# Altium schematic sheet Display Interfaces.SchDoc
size Tabloid; DrawnBy: Krutav Shah; SheetNumber: 6; SheetTotal: 7
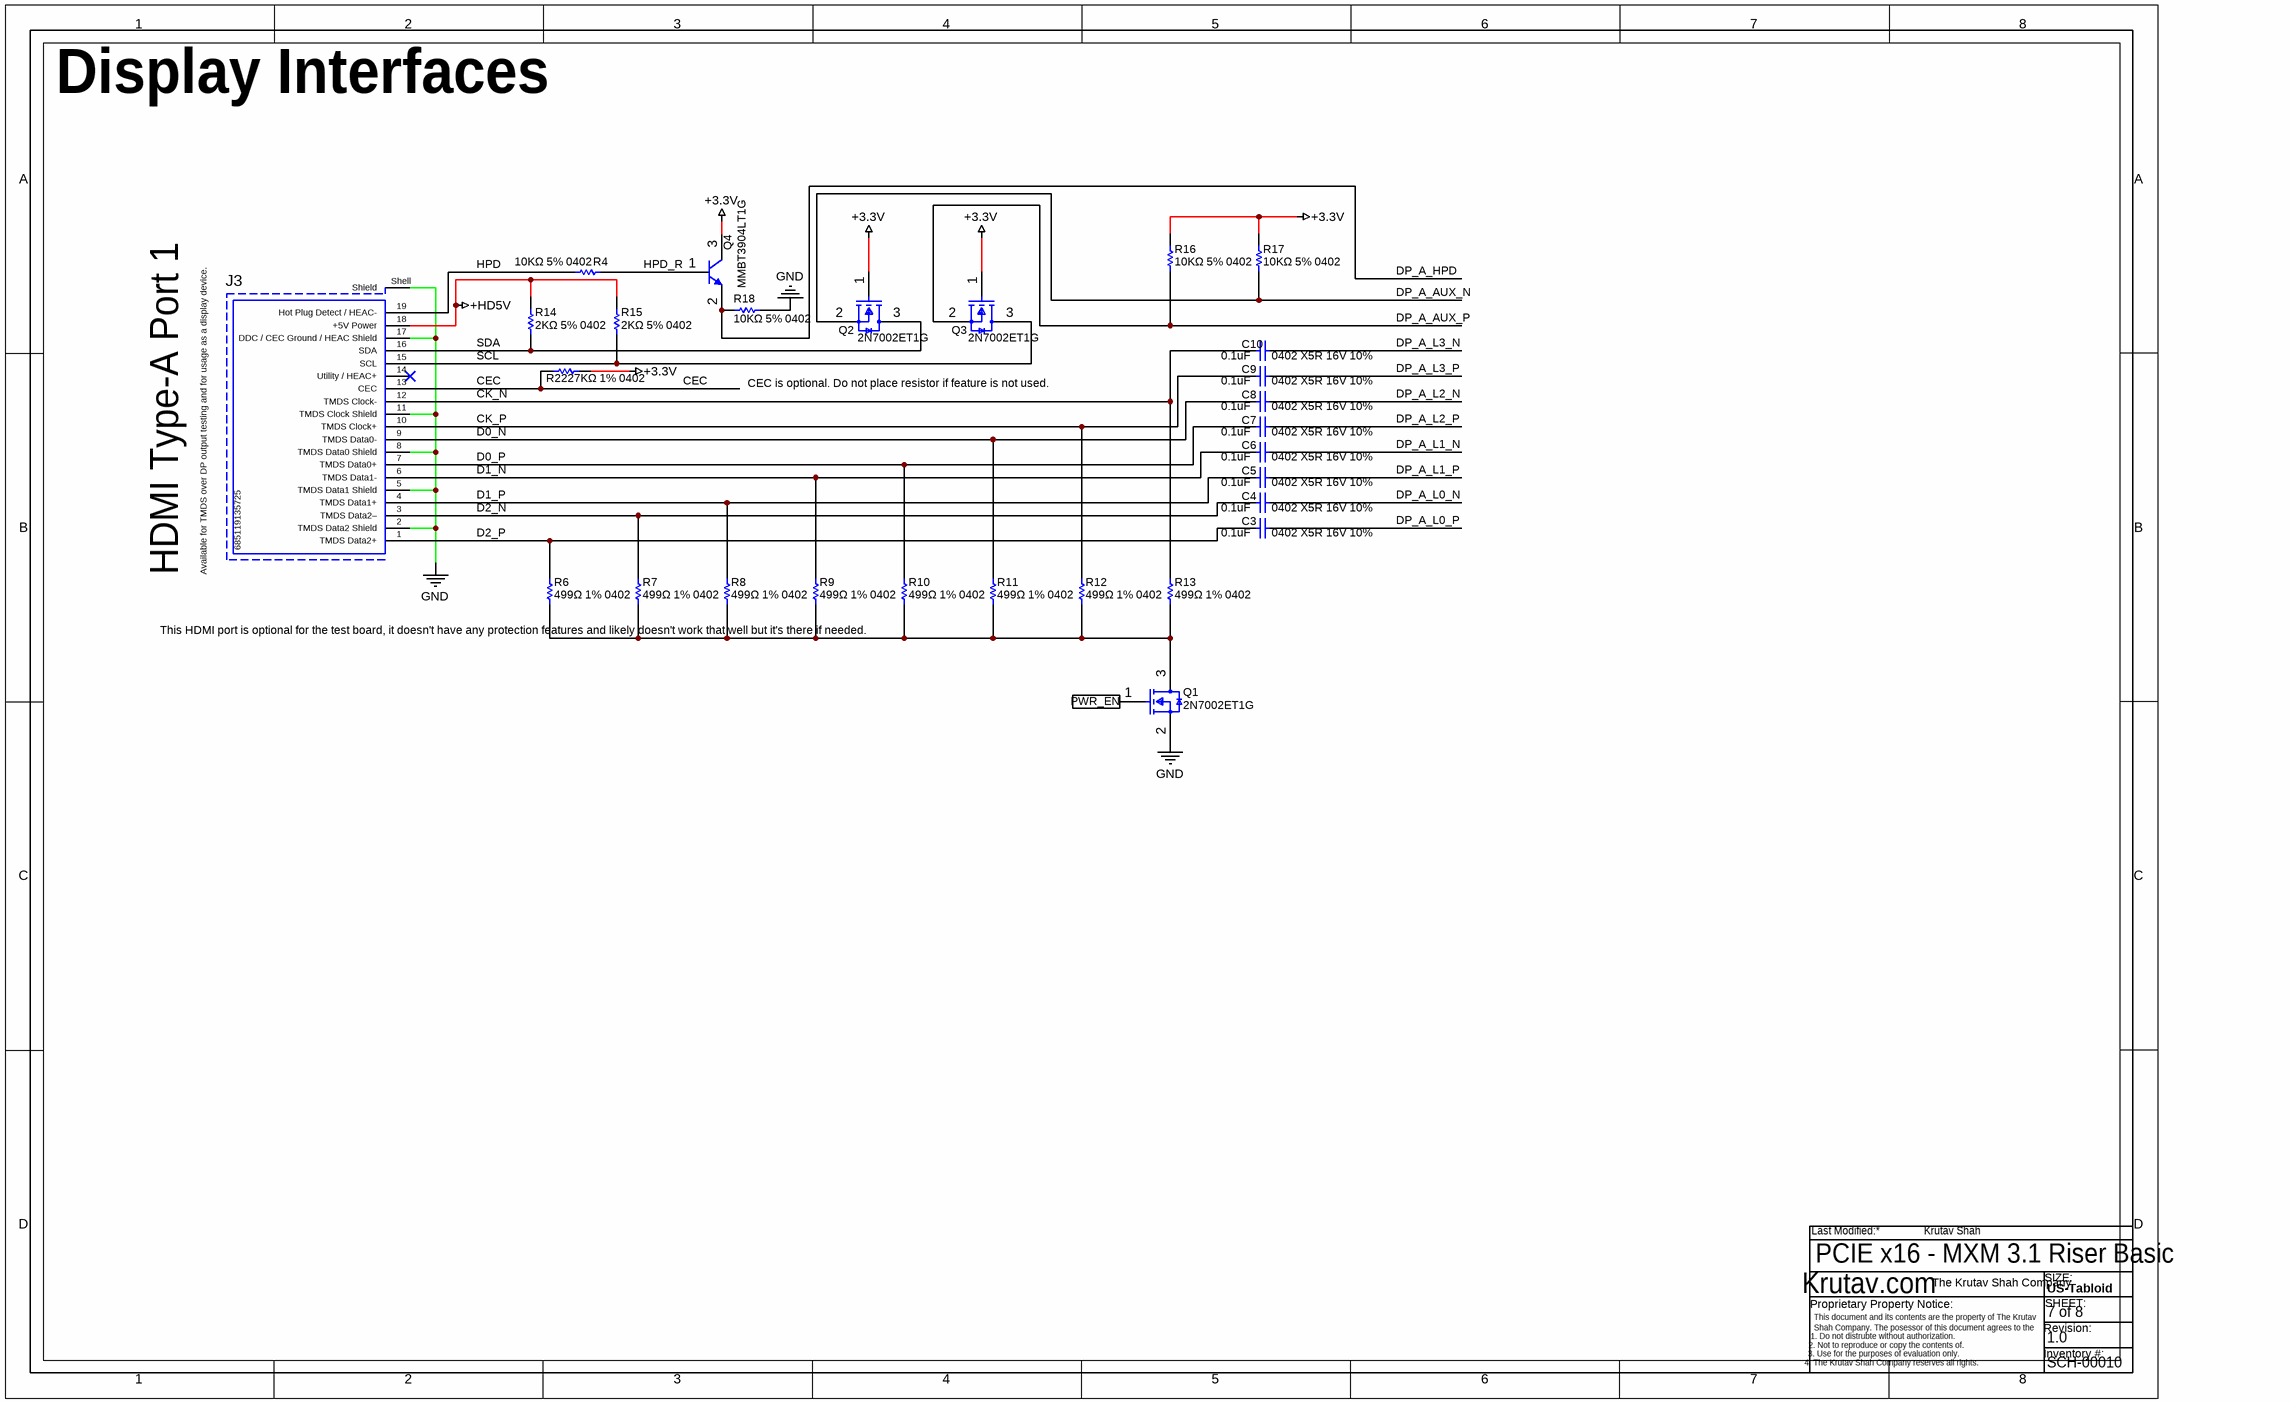
[diagram p0: Display Interfaces.SchDoc]

## Parts
C3  0.1uF       0402 X5R 16V 10%  [CAPC0603X33X15NL03T05]
C4  0.1uF       0402 X5R 16V 10%  [CAPC0603X33X15NL03T05]
C5  0.1uF       0402 X5R 16V 10%  [CAPC0603X33X15NL03T05]
C6  0.1uF       0402 X5R 16V 10%  [CAPC0603X33X15NL03T05]
C7  0.1uF       0402 X5R 16V 10%  [CAPC0603X33X15NL03T05]
C8  0.1uF       0402 X5R 16V 10%  [CAPC0603X33X15NL03T05]
C9  0.1uF       0402 X5R 16V 10%  [CAPC0603X33X15NL03T05]
C10  0.1uF       0402 X5R 16V 10%  [CAPC0603X33X15NL03T05]
J3  685119135725  [685119135725]
Q1  2N7002ET1G  [FP-318-08-IPC_A]
Q2  2N7002ET1G  [FP-318-08-IPC_A]
Q3  2N7002ET1G  [FP-318-08-IPC_A]
Q4  MMBT3904LT1G  [ONSC-SOT-23-3-318-08_V]
R4  10KΩ 5% 0402  [RESC0201(0603)_L]
R6  499Ω 1% 0402  [RESC0201(0603)_L]
R7  499Ω 1% 0402  [RESC0201(0603)_L]
R8  499Ω 1% 0402  [RESC0201(0603)_L]
R9  499Ω 1% 0402  [RESC0201(0603)_L]
R10  499Ω 1% 0402  [RESC0201(0603)_L]
R11  499Ω 1% 0402  [RESC0201(0603)_L]
R12  499Ω 1% 0402  [RESC0201(0603)_L]
R13  499Ω 1% 0402  [RESC0201(0603)_L]
R14  2KΩ 5% 0402  [RESC0201(0603)_L]
R15  2KΩ 5% 0402  [RESC0201(0603)_L]
R16  10KΩ 5% 0402  [RESC0201(0603)_L]
R17  10KΩ 5% 0402  [RESC0201(0603)_L]
R18  10KΩ 5% 0402  [RESC0201(0603)_L]
R22  27KΩ 1% 0402  [RESC0201(0603)_L]

## Ports
PWR_EN

## Nets
+3.3V: Q2.1(Gate) Q3.1(Gate) Q4.3(C) R16.1 R17.1 R22.1
+HD5V: J3.18(+5V_Power) R14.1 R15.1
GND: J3.2(TMDS_Data2_Shield) J3.5(TMDS_Data1_Shield) J3.8(TMDS_Data0_Shield) J3.11(TMDS_Clock_Shield) J3.17(DDC_/_CEC_Ground_/_HEAC_Shield) J3.Shell(Shield) Q1.2(Source) R18.2
CEC: J3.13(CEC) R22.2
CK_N: C10.1 J3.12(TMDS_Clock-) R13.1
CK_P: C9.1 J3.10(TMDS_Clock+) R12.1
D0_N: C8.1 J3.9(TMDS_Data0-) R11.1
D0_P: C7.1 J3.7(TMDS_Data0+) R10.1
D1_N: C6.1 J3.6(TMDS_Data1-) R9.1
D1_P: C5.1 J3.4(TMDS_Data1+) R8.1
D2_N: C4.1 J3.3(TMDS_Data2–) R7.1
D2_P: C3.1 J3.1(TMDS_Data2+) R6.1
DP_A_AUX_N: Q2.2(Source) R17.2
DP_A_AUX_P: Q3.2(Source) R16.2
DP_A_HPD: Q4.2(E) R18.1
DP_A_L0_N: C4.2
DP_A_L0_P: C3.2
DP_A_L1_N: C6.2
DP_A_L1_P: C5.2
DP_A_L2_N: C8.2
DP_A_L2_P: C7.2
DP_A_L3_N: C10.2
DP_A_L3_P: C9.2
HPD: J3.19(Hot_Plug_Detect_/_HEAC-) R4.2
HPD_R: Q4.1(B) R4.1
PWR_EN: Q1.1(Gate) ; port PWR_EN
SCL: J3.15(SCL) Q3.3(Drain) R15.2
SDA: J3.16(SDA) Q2.3(Drain) R14.2
NetQ1_3: Q1.3(Drain) R6.2 R7.2 R8.2 R9.2 R10.2 R11.2 R12.2 R13.2

Not connected (* = marked no-connect by the designer): J3 14(Utility_/_HEAC+)*

## Layout directives
differential pair: CK_N, CK_P, D0_N, D0_P, D1_N, D1_P, D2_N, D2_P, DP_A_AUX_N, DP_A_AUX_P, DP_A_L0_N, DP_A_L0_P, DP_A_L1_N, DP_A_L1_P, DP_A_L2_N, DP_A_L2_P, DP_A_L3_N, DP_A_L3_P

## Notes on the sheet
- Display Interfaces
- CEC is optional. Do not place resistor if feature is not used.
- HDMI Type-A Port 1
- Available for TMDS over DP output testing and for usage as a display device.
- This HDMI port is optional for the test board,
  it doesn't have any protection features and likely
  doesn't work that well but it's there if needed.
- PCIE x16 - MXM 3.1 Riser Basic
- 7 of 8
- 1.0
- SCH-00010
- Last Modified:
- Krutav.com
- The Krutav Shah Company
- US-Tabloid
- SIZE:
- SHEET:
- This document and its contents are the property of The Krutav Shah Company. The posessor of this document agrees to the following:
- Proprietary Property Notice:
- 1. Do not distrubte without authorization.
- 3. Use for the purposes of evaluation only.
- 2. Not to reproduce or copy the contents of.
- 4. The Krutav Shah Company reserves all rights.
- Revision:
- Inventory #:

## Library data of the parts
C3-C10 = CMP-2010-00679-1: Manufacturer: Samsung; Part Number: CL03A224MQ3NNNC
J3 = CMP-1502-00170-1: HDMI Type A Receptacle WR-COM, Horizontal, SMT, with M3 Screw Flange; Manufacturer: Wurth Elektronik; Working Voltage: 40VAC; Rated Current: 0.5A; Contact Resistance: 30mOhm; Gender: Receptacle; Publisher: WurthElektronik; Connector Type: HDMITypeA; Manufacturer URL: http://www.we-online.de; Datasheet URL: https://katalog.we-online.de/em/datasheet/685119135725.pdf; Packaging: Tray; Operating Temperature: -20to85degC; Package Reference: 685119135725; Mounting Technology: SMT; Orientation: Horizontal; Part Number: 685119135725
Q1-Q3 = CMP-1058-00769-2: MOSFET N-CH 60V 260MA SOT-23; On-State Resistance: 2.5R; Turn-Off Delay Time: 4.8ns; Nominal Vgs: 1V; Element Configuration: Single; Rise Time: 1.2ns; Input Capacitance: 26.7pF; Number of Elements: 1; Turn-On Delay Time: 1.7ns; Gate to Source Voltage (Vgs): 20V; Max Power Dissipation: 300mW; Drain to Source Breakdown Voltage: 60V; Max Operating Temperature: 150°C; REACH SVHC: No SVHC; Case/Package: SOT-23-3; Lead Free: Lead Free; Length: 2.9mm; Height: 0.94mm; Package Quantity: 3000; Min Operating Temperature: -55°C; Radiation Hardening: No; Packaging: Tape and Reel; Fall Time: 1.2ns; Drain to Source Resistance: 2.5R; Halogen Free: Halogen Free; Threshold Voltage: 1V; Number of Pins: 3; Continuous Drain Current (ID): 260mA; Rds On Max: 2.5R; Power Dissipation: 300mW; Width: 1.3mm
Q4 = CMP-1048-00631-1: General Purpose Transistor, NPN Silicon, 3-Pin SOT-23, Pb-Free, Tape and Reel; Manufacturer: On Semiconductor; IC Continuous (A): 0.2; fT Min (MHz): 300; ComponentLink2Description: Datasheet; Polarity: NPN; PackageDescription: 3-Pin Small Outline Transistor, Body 2.92 x 1.3 mm, Pitch 0.95 mm; ComponentLink2URL: http://www.onsemi.cn/pub_link/Collateral/MMBT3904LT1-D.PDF; DatasheetVersion: Rev. 12; Mounting Technology: Surface Mount; PartNumber: MMBT3904LT1G; ComponentLink1URL: http://www.onsemi.com/; ComponentLink3Description: Package Specification; ComponentLink1Description: Manufacturer URL; PackageVersion: Rev. AP, 11/2009; PackageReference: SOT-23-3-318-08; Packing: Tape and Reel; ComponentLink3URL: http://www.onsemi.cn/pub_link/Collateral/318-08.PDF; RoHS: TRUE
R4 R6-R18 R22 = CMP-1010-00755-1: 1M 0.05W 1% 0201 (0603 Metric)  SMD; Case-Metric: 0603; Value: 1000000.00 Ohm; Case-EIA: 0201; Technology: SMT; Tolerance: 1 %; Power: 0.05 W